# EAGLE design toby_little_bits_2 (EAGLE 6.4)
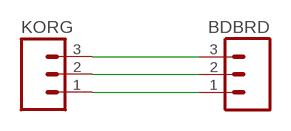
[diagram p0: schematic, sheet 1]

## Parts
BDBRD  M03PTH  [1X03]
KORG  M03SMD  [1X03-1MM-RA]

## Nets
N$1: BDBRD.3 KORG.3
N$2: BDBRD.2 KORG.2
N$3: BDBRD.1 KORG.1

## Library data of the parts
BDBRD KORG = SparkFun:M03: Header 3 Standard 3-pin 0.1" header. Use with straight break away headers (SKU : PRT-00116), right angle break away headers (PRT-00553), swiss pins (PRT-00743), machine pins (PRT-00117), and female headers (PRT-00115). Molex polarized connector foot print use with SKU : PRT-08232 with associated crimp pins and housings.

## Board
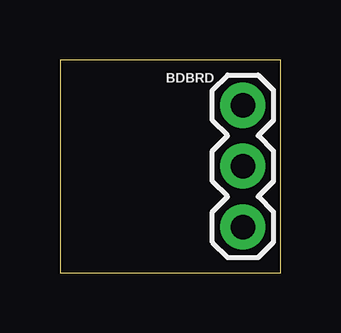
[diagram p1: board, top side]
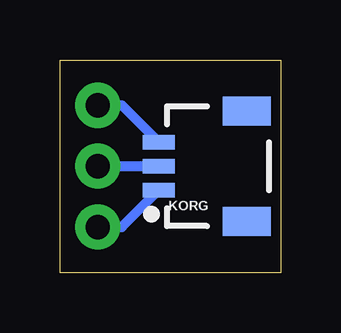
[diagram p2: board, bottom side, seen from below]

Size 9.2 x 8.88 mm. Coordinates in mm from the lower left corner, seen from the top.
Outline: 0,0 9.2,0 9.2,8.88 0,8.88 0,0
Copper layers (1*16): Top 0.035mm / dielectric 1.5mm / Bottom 0.035mm
Design rules "default": minimum track width 10mil, minimum drill 24mil, track to track 8mil, track to pad 8mil, pad to pad 8mil, via to via 8mil, smd to smd 8mil, copper to edge 40mil, drill to drill 8mil, minimum pad ring 10mil, minimum via ring 8mil, stop-mask expansion 4mil, vias tented up to drill 0mil, thermal gap 10mil

### Footprints (pad centres in the part's own frame; a part is rotated, then mirrored left to right if it is on the bottom)
1X03 = drill 1.016 pad 1.88: 1 0,0; 2 2.54,0; 3 5.08,0
1X03-1MM-RA = smd 0.6 x 1.35: 1 -1,0; 2 0,0; 3 1,0 | smd 1.2 x 2: NC1 2.3,-3.675; NC2 -2.3,-3.675

### Placement (x,y rotation side)
BDBRD  7.62,1.91 90 top
KORG  5.08,4.45 90 bottom

### Tracks (layer width: path | path; a pad name or v marks a point on that pad's centre or on a via)
N$1
  Bottom 0.406: BDBRD.3 6.62,6.99 KORG.3
N$2
  Bottom 0.406: BDBRD.2 KORG.2
N$3
  Bottom 0.406: BDBRD.1 6.62,1.91 KORG.1